# Altium schematic sheet MC21R01_uC_Support.SchDoc: MC21R01 Top Level
size A3; Author: AMP; DrawnBy: AMP; Organization: Altium Limited; Address1: 3 Minna Close; Address2: Belrose; Address3: NSW 2085; Address4: Australia; DocumentNumber: 0; Revision: 1.0; SheetNumber: 0; SheetTotal: 0
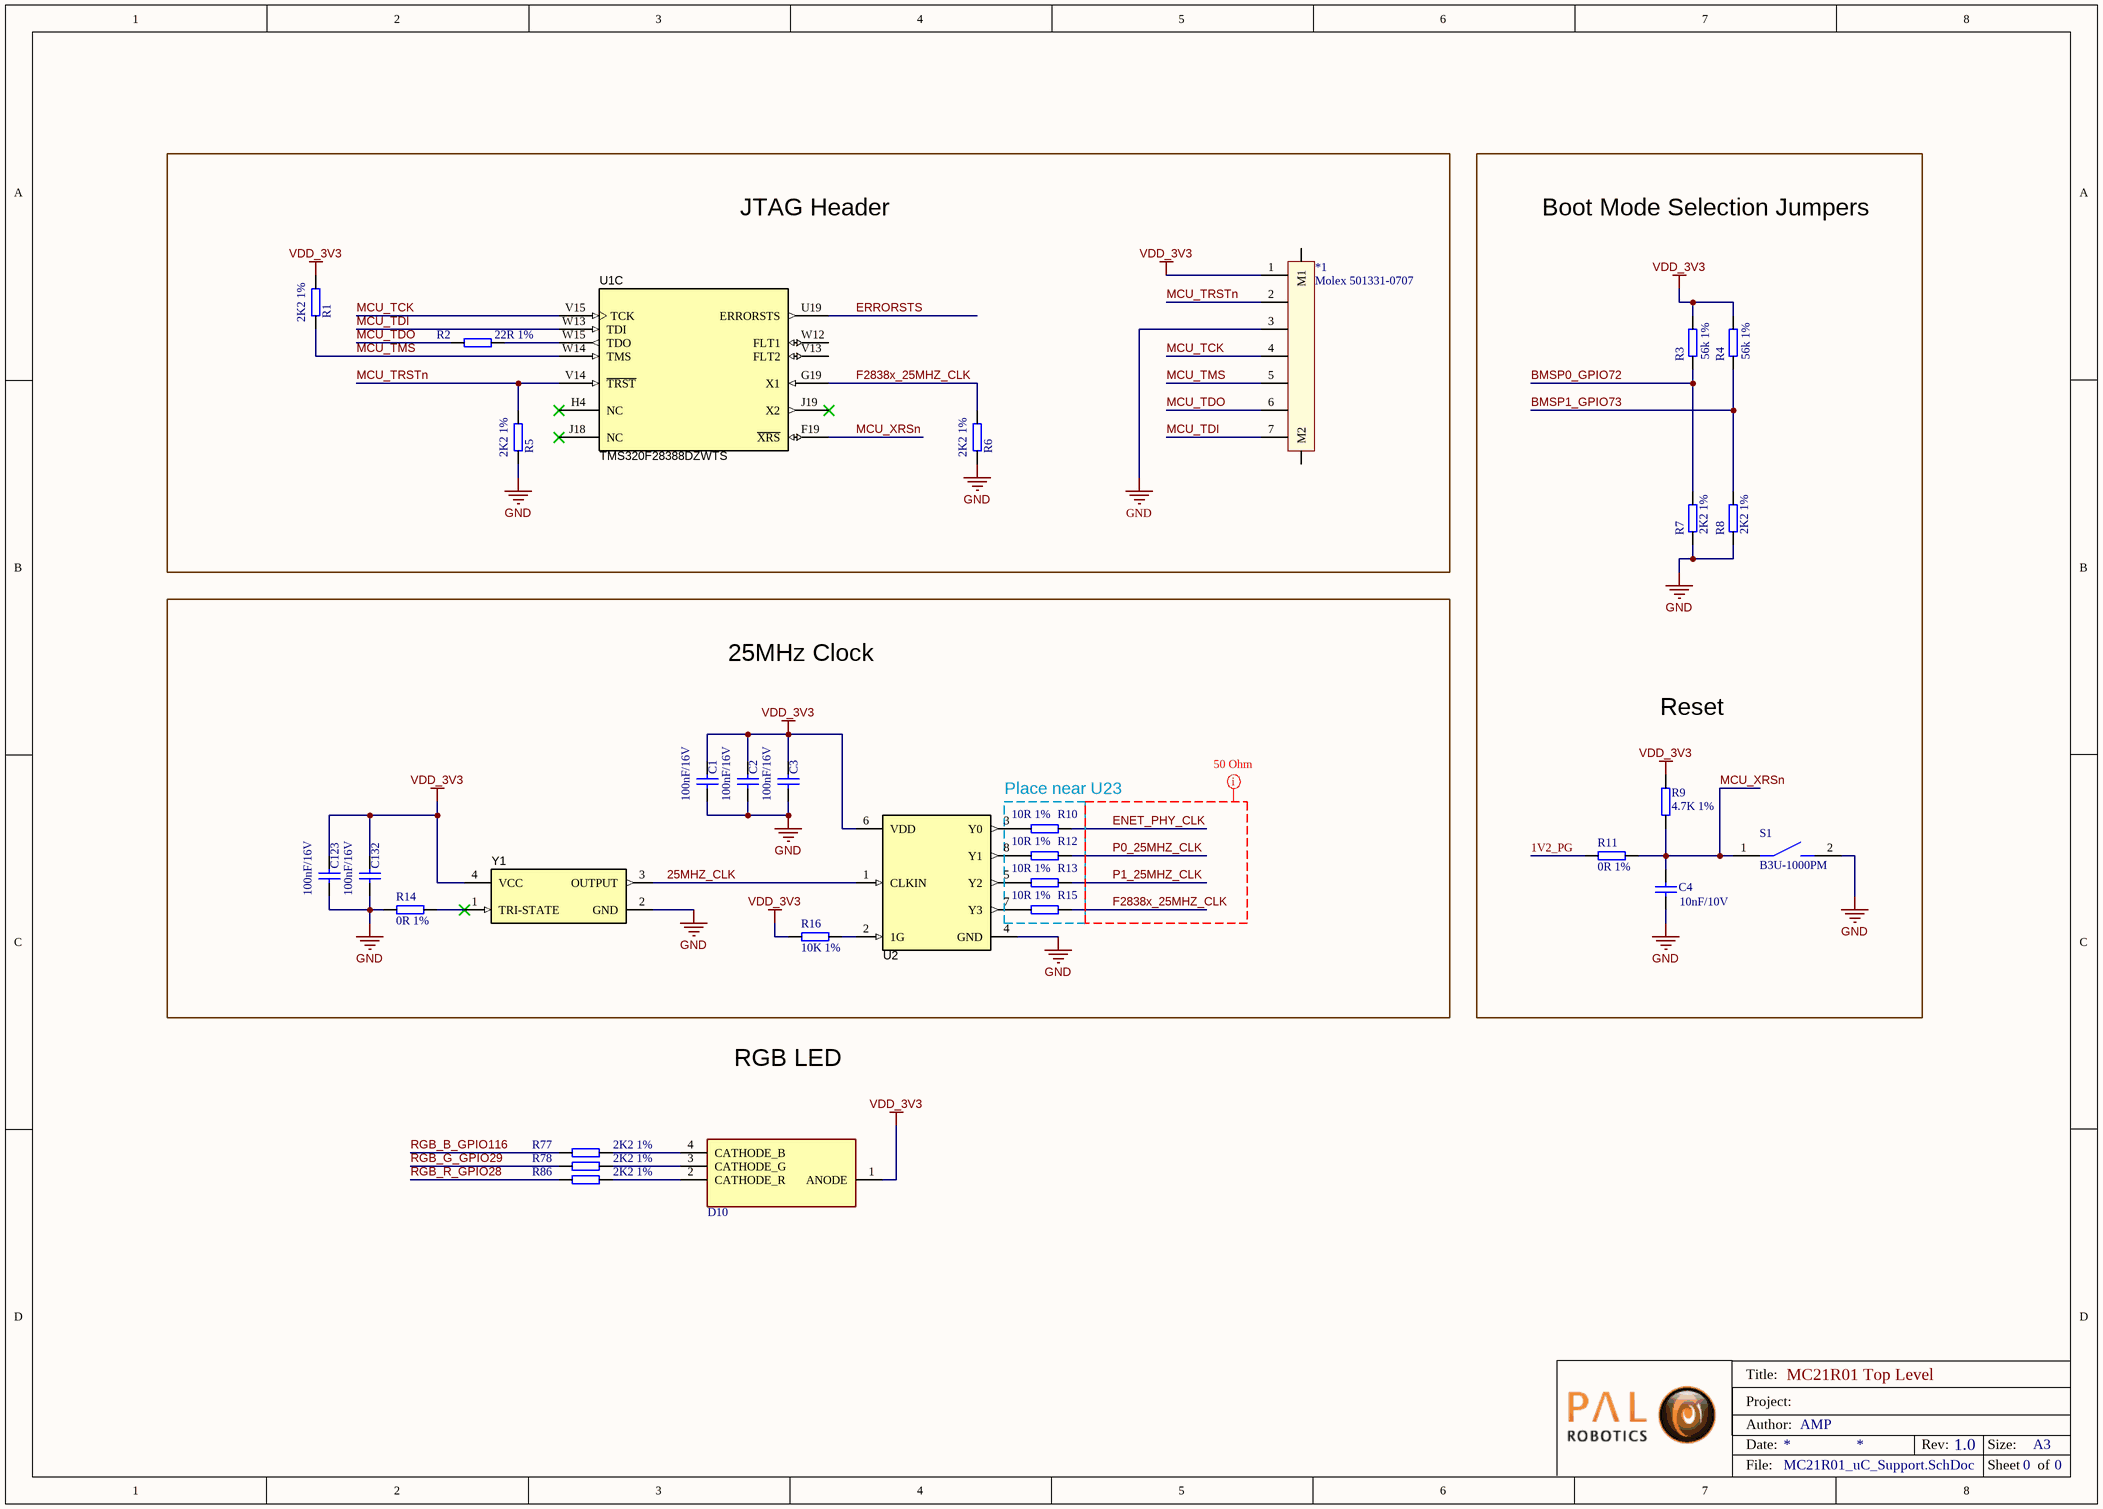
[diagram p0: MC21R01_uC_Support.SchDoc]

## Parts
*1  Molex 501331-0707  [Molex 501331-0707]
C1  value 100nF/16V  [0402 SMD Capacitor]  (hidden comment: 100nF/16V 0402 10% X7R)
C2  value 100nF/16V  [0402 SMD Capacitor]  (hidden comment: 100nF/16V 0402 10% X7R)
C3  value 100nF/16V  [0402 SMD Capacitor]  (hidden comment: 100nF/16V 0402 10% X7R)
C4  value 10nF/10V  [0402 SMD Capacitor]  (hidden comment: 10nF/10V 0402 20% X5R)
C123  value 100nF/16V  [0402 SMD Capacitor]  (hidden comment: 100nF/16V 0402 10% X7R)
C132  value 100nF/16V  [0402 SMD Capacitor]  (hidden comment: 100nF/16V 0402 10% X7R)
D10  RGB LED  [LRTB R48G]  (value not drawn)
R1  2K2 1%  [0402 SMD rESISTOR]
R2  22R 1%  [0402 SMD rESISTOR]
R3  56k 1%  [0402 SMD rESISTOR]
R4  56k 1%  [0402 SMD rESISTOR]
R5  2K2 1%  [0402 SMD rESISTOR]
R6  2K2 1%  [0402 SMD rESISTOR]
R7  2K2 1%  [0402 SMD rESISTOR]
R8  2K2 1%  [0402 SMD rESISTOR]
R9  4.7K 1%  [0402 SMD rESISTOR]
R10  10R 1%  [0402 SMD rESISTOR]
R11  0R 1%  [0402 SMD rESISTOR]
R12  10R 1%  [0402 SMD rESISTOR]
R13  10R 1%  [0402 SMD rESISTOR]
R14  0R 1%  [0402 SMD rESISTOR]
R15  10R 1%  [0402 SMD rESISTOR]
R16  10K 1%  [0402 SMD rESISTOR]
R77  2K2 1%  [0402 SMD rESISTOR]
R78  2K2 1%  [0402 SMD rESISTOR]
R86  2K2 1%  [0402 SMD rESISTOR]
S1  B3U-1000PM  [B3U1000PM]
U1  TMS320F28388DZWTS  [ZWT0337A]  (part C of 5)
U2  LMK1C1104PWR  [SOP65P640X120-8N]  (value not drawn)
Y1  ECS-2520S33-250-FN-TR  [ECS_ECS-2520S]  (value not drawn)

## Blocks framed on the sheet
JTAG Header: *1 R1 R2 R5 R6 U1
25MHz Clock: C1-C3 C123 C132 R10 R12-R16 U2 Y1

## Nets
GND: *1.3 C1.2 C2.2 C3.2 C4.2 C123.2 C132.2 R5.1 R6.1 R7.1 R8.1 R14.2 S1.2(NO) U2.4(GND) Y1.2(GND)
VDD_3V3: *1.1 C1.1 C2.1 C3.1 C123.1 C132.1 D10.1(ANODE) R1.2 R3.2 R4.2 R9.2 R16.2 U2.6(VDD) Y1.4(VCC)
1V2_PG: R11.2
25MHZ_CLK: U2.1(CLKIN) Y1.3(OUTPUT)
BMSP0_GPIO72: R3.1 R7.2
BMSP1_GPIO73: R4.1 R8.2
ENET_PHY_CLK: R10.1
ERRORSTS: U1.U19(ERRORSTS)
F2838x_25MHZ_CLK: R6.2 R15.1 U1.G19(X1)
MCU_TCK: *1.4 U1.V15(TCK)
MCU_TDI: *1.7 U1.W13(TDI)
MCU_TDO: *1.6 R2.2
MCU_TMS: *1.5 R1.1 U1.W14(TMS)
MCU_TRSTn: *1.2 R5.2 U1.V14(~{TRST})
MCU_XRSn: C4.1 R9.1 R11.1 S1.1(COM) U1.F19(~{XRS})
P0_25MHZ_CLK: R12.1
P1_25MHZ_CLK: R13.1
RGB_B_GPIO116: R77.2
RGB_G_GPIO29: R78.2
RGB_R_GPIO28: R86.2
NetD10_2: D10.2(CATHODE_R) R86.1
NetD10_3: D10.3(CATHODE_G) R78.1
NetD10_4: D10.4(CATHODE_B) R77.1
NetR2_1: R2.1 U1.W15(TDO)
NetR10_2: R10.2 U2.3(Y0)
NetR12_2: R12.2 U2.8(Y1)
NetR13_2: R13.2 U2.5(Y2)
NetR14_1: R14.1 Y1.1(TRI-STATE)
NetR15_2: R15.2 U2.7(Y3)
NetR16_1: R16.1 U2.2(1G)

Not connected (* = marked no-connect by the designer): *1 M1 M2; U1 H4(NC)* J18(NC)* J19(X2)* V13(FLT2) W12(FLT1)

## Layout directives
50 Ohm Impedance: Undefined: ENET_PHY_CLK, F2838x_25MHZ_CLK, P0_25MHZ_CLK, P1_25MHZ_CLK

## Notes on the sheet
- Boot Mode Selection Jumpers
- Reset
- Place near U23
- RGB LED
- Title:
- Date:
- Project:
- Author:
- Rev:
- Size:
- A3
- File:
- Sheet
- of

## Library data of the parts
*1 = Molex 501331-0707: PicoClasp 07 pin vertical; Supplier 1: Digi-Key; Supplier Part Number 1: WM7884TR-ND
C1-C3 C123 C132 = 100nF/16V 0402 10% X7R: 100nF/16V 0402 10% Tolerance X7R Multilayer Ceramic Chip Capacitor; Manufacturer 1: SAMSUNG; Manufacturer Part Number 1: CL05B104KO5VPNC; Supplier Part Number 1: 3013350; Supplier 1: Farnell
C4 = 10nF/10V 0402 20% X5R: 10nF/10V 0402 20% Tolerance X5R Multilayer Ceramic Chip Capacitor; Manufacturer 1: KEMET; Manufacturer Part Number 1: C0402C103K8PACTU; Supplier Part Number 1: 2773069; Supplier 1: Farnell
D10 = LRTB_R48G: RGB LED, SMD 1x1mm common anode; Manufacturer: OSRAM; Datasheet Link: https://dammedia.osram.info/media/resource/hires/osram-dam-4307982/LRTB%20R48G.pdf; Height: 0.65mm; Manufacturer Part Number: LRTB R48G; Supplier 1: Farnell; Supplier Part Number 1: 2981676; Created by: AMP; Published: 24-08-2020
R1 R5-R8 R77 R78 R86 = 2K2/50V 1% 0402 100mW: 2K2/50V 1% 0402 100mW SMD Resistor; Manufacturer 1: Yageo; Manufacturer Part Number 1: RC0402FR-072K2L; Value: 2.2k; Supplier 1: Farnell; Supplier Part Number 1: 9239278
R2 = 22R/50V 1% 0402 63mW: 22R/50V 1% 0402 63mW SMD Resistor; Manufacturer 1: Vishay; Manufacturer Part Number 1: CRCW040222R0FKED; Supplier 1: Farnell; Supplier Part Number 1: 1469697; Value: 22R
R3 R4 = 56k/50V 1% 0402 100mW: 56k/50V 1% 0402 63mW SMD Resistor; Manufacturer 1: Yageo; Manufacturer Part Number 1: RC0402FR-0756KL; Supplier 1: Farnell; Supplier Part Number 1: 9239448; Value: 56k
R9 = 4.7K/50V 1% 0402 100mW: 4.7K/50V 1% 0402 100mW SMD Resistor; Manufacturer 1: Vishay; Manufacturer Part Number 1: CRCW04024K70FKED; Supplier 1: Farnell; Supplier Part Number 1: 1469712; Value: 4.7K
R10 R12 R13 R15 = 10R/50V 1% 0402 63mW: 10R/50V 1% 0402 63mW SMD Resistor; Manufacturer 1: Yageo; Manufacturer Part Number 1: RC0402FR-0710RL; Supplier 1: Farnell; Supplier Part Number 1: 9238999; Value: 10R
R11 R14 = 0R/50V 1% 0402 100mW: 0R/50V 1% 0402 100mW SMD Resistor; Manufacturer 1: Vishay; Manufacturer Part Number 1: CRCW04020000Z0ED; Supplier 1: Farnell; Supplier Part Number 1: 1469661; Value: 0R
R16 = 10K/50V 1% 0402 100mW: 10K/50V 1% 0402 100mW SMD Resistor; Manufacturer 1: Yageo; Manufacturer Part Number 1: RC0402FR-0710KL; Supplier 1: Farnell; Supplier Part Number 1: 9239359; Value: 10K
S1 = B3U-1000PM: Tactile switch, top actuator; Manufacturer: Omron Electronics; Datasheet Link: https://componentsearchengine.com/Datasheets/1/B3U-1000PM.pdf; Height: 1.75mm; Manufacturer Part Number: B3U-1000PM; Arrow Part Number: B3U-1000PM; Supplier 1: Mouser; Supplier Part Number 1: 653-B3U-1000PM; Mouser Price/Stock: https://www.mouser.co.uk/ProductDetail/Omron-Electronics/B3U-1000PM?qs=hnUcNC2tU0oiJUWqjOlHqA%3D%3D; Created by: AMP; Published: 26-08-2020
U1 = TMS320F28388: TMS320F28388DZWTS, ZWT0337A (NFBGA-337); Manufacturer: Texas Instruments; SizeAreaWB_mm2: 324; SizeArea_mm2: 256; AEC Qualified: N; AEC Category: Q200; SizeZ_mm: 1.4; SizeY_mm: 16; CompType: IC; ComponentLink1Description: Datasheet Link; ComponentLink2Description: Product Folder; PackageReference: ZWT0337A; PackageDescription: NFBGA-337; ComponentLink2URL: http://www.ti.com/product/tms320f28388d; Alternate Manufacturer: Texas Instruments; ComponentLink3URL: http://www.ti.com/product/tms320f28388d/datasheet; ComponentLink1URL: http://www.ti.com/lit/ds/symlink/tms320f28388d.pdf; MountType: SMT; ComponentLink3Description: Online Datasheet; SizeX_mm: 16; PartNumber: TMS320F28388DZWTS
U2 = LMK1C1104PWR: Low Jitter, 1:4 LVCMOS Fan-out Clock Buffer, PW0008A (TSSOP-8); Alternate Manufacturer: Texas Instruments; Green_Lifecycle: Active; SizeAreaWB_mm2: 42.0; Green_REACh: Passed; U/M: EA; SizeZ_mm: 1.2; SizeX_mm: 6.4; SizeY_mm: 3.0; SizeArea_mm2: 19.2; CompType: IC; ComponentLink1URL: http://www.ti.com/lit/ds/symlink/cdclvc1104.pdf; Publisher: Texas Instruments; PackageDescription: TSSOP-8; RoHS: Y; MountType: SMT; Green_EU RoHS-2: Passed; Manufacturer: Texas Instruments; Green_EU RoHS: Passed; PackageReference: PW0008A; PartNumber: LMK1C1104PWR; ComponentLink1Description: Datasheet Link; Supplier 1: Mouser; Supplier Part Number 1: 595-LMK1C1104PWR
Y1 = CMP-0082061-1: Oscillator, 25 MHz, 15 pF, SMD; Manufacturer: ECS Inc.; Frequency Stability: 10 ppm; SizeAreaWB_mm2: 10.5; SizeArea_mm2: 5; AEC Qualified: N; AEC Category: Q200; TaMax_C: 85°C; SizeZ_mm: 1; Frequency_Fixed: 25MHz; TaMin_C: -40°C; SizeY_mm: 2.5; Load Capacitance: 15 pF; SizeX_mm: 2; ComponentLink1Description: Datasheet Link; RoHS: Y; Supplier 1: Digi-Key; PackageReference: 2x2.5mm; PartNumber: ECS-2520S33-250-FN-TR; Supplier Part Number 2: 520-2520S33-250-FNT; Supplier 2: Mouser; AEC Grade: N/A; ComponentLink1URL: https://www.ecsxtal.com/store/pdf/ECS-2520S.pdf; CompType: Oscillator; Supplier Part Number 1: XC2198CT-ND; MountType: SMT